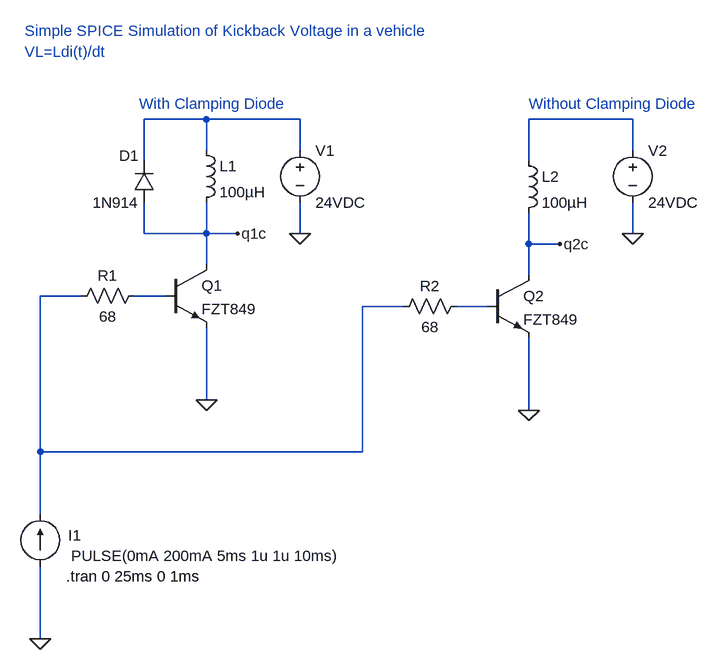
[diagram p0: schematic Simple Coil Kickback SPICE simulation.asc]
Simple Coil Kickback SPICE simulation.asc, the LTspice schematic file:
Version 4
SHEET 1 968 772
WIRE -80 -128 -176 -128
WIRE 64 -128 -80 -128
WIRE 576 -128 416 -128
WIRE -80 -80 -80 -128
WIRE 64 -80 64 -128
WIRE 576 -80 576 -128
WIRE -176 -64 -176 -128
WIRE 416 -64 416 -128
WIRE -176 48 -176 0
WIRE -80 48 -80 0
WIRE -80 48 -176 48
WIRE -32 48 -80 48
WIRE 64 48 64 0
WIRE 576 48 576 0
WIRE 416 64 416 16
WIRE 464 64 416 64
WIRE -80 96 -80 48
WIRE 416 112 416 64
WIRE -272 144 -336 144
WIRE -144 144 -192 144
WIRE 224 160 160 160
WIRE 352 160 304 160
WIRE -80 304 -80 192
WIRE 416 320 416 208
WIRE -336 384 -336 144
WIRE 160 384 160 160
WIRE 160 384 -336 384
WIRE -336 480 -336 384
WIRE -336 672 -336 560
FLAG -80 304 0
FLAG 416 320 0
FLAG 576 48 0
FLAG -336 672 0
FLAG 64 48 0
FLAG 464 64 q2c
FLAG -32 48 q1c
SYMBOL diode -160 0 R180
WINDOW 0 24 72 Left 0
WINDOW 3 24 0 Left 0
SYMATTR InstName D1
SYMATTR Value 1N914
SYMBOL npn -144 96 R0
SYMATTR InstName Q1
SYMATTR Value FZT849
SYMBOL npn 352 112 R0
SYMATTR InstName Q2
SYMATTR Value FZT849
SYMBOL voltage 576 -96 R0
WINDOW 123 0 0 Left 0
WINDOW 39 0 0 Left 0
SYMATTR InstName V2
SYMATTR Value 24VDC
SYMBOL ind -96 -96 R0
SYMATTR InstName L1
SYMATTR Value 100µH
SYMBOL ind 400 -80 R0
SYMATTR InstName L2
SYMATTR Value 100µH
SYMBOL current -336 560 R180
WINDOW 0 -63 47 Left 0
WINDOW 3 -461 16 Left 0
WINDOW 123 0 0 Left 0
WINDOW 39 0 0 Left 0
SYMATTR InstName I1
SYMATTR Value PULSE(0mA 200mA 5ms 1u 1u 10ms)
SYMBOL res -288 160 R270
WINDOW 0 32 56 VTop 0
WINDOW 3 0 56 VBottom 0
SYMATTR InstName R1
SYMATTR Value 68
SYMBOL res 208 176 R270
WINDOW 0 32 56 VTop 0
WINDOW 3 0 56 VBottom 0
SYMATTR InstName R2
SYMATTR Value 68
SYMBOL voltage 64 -96 R0
WINDOW 123 0 0 Left 0
WINDOW 39 0 0 Left 0
SYMATTR InstName V1
SYMATTR Value 24VDC
TEXT -360 -264 Left 0 ;Simple SPICE Simulation of Kickback Voltage in a vehicle
TEXT -296 576 Left 0 !.tran 0 25ms 0 1ms
TEXT -184 -152 Left 0 ;With Clamping Diode
TEXT 416 -152 Left 0 ;Without Clamping Diode
TEXT -360 -232 Left 0 ;VL=Ldi(t)/dt

The netlist it stands for:
* Simple Coil Kickback SPICE simulation.asc
D1 q1c N001 1N914
Q1 q1c N004 0 0 FZT849
Q2 q2c N005 0 0 FZT849
V2 N002 0 24VDC
L1 N001 q1c 100µH
L2 N002 q2c 100µH
I1 0 N003 PULSE(0mA 200mA 5ms 1u 1u 10ms)
R1 N003 N004 68
R2 N003 N005 68
V1 N001 0 24VDC
.model D D
.lib standard.dio
.model NPN NPN
.model PNP PNP
.lib standard.bjt
* Simple SPICE Simulation of Kickback Voltage in a vehicle
.tran 0 25ms 0 1ms
* With Clamping Diode
* Without Clamping Diode
* VL=Ldi(t)/dt
.backanno
.end